# Altium schematic sheet 04-LCD.SchDoc
size C
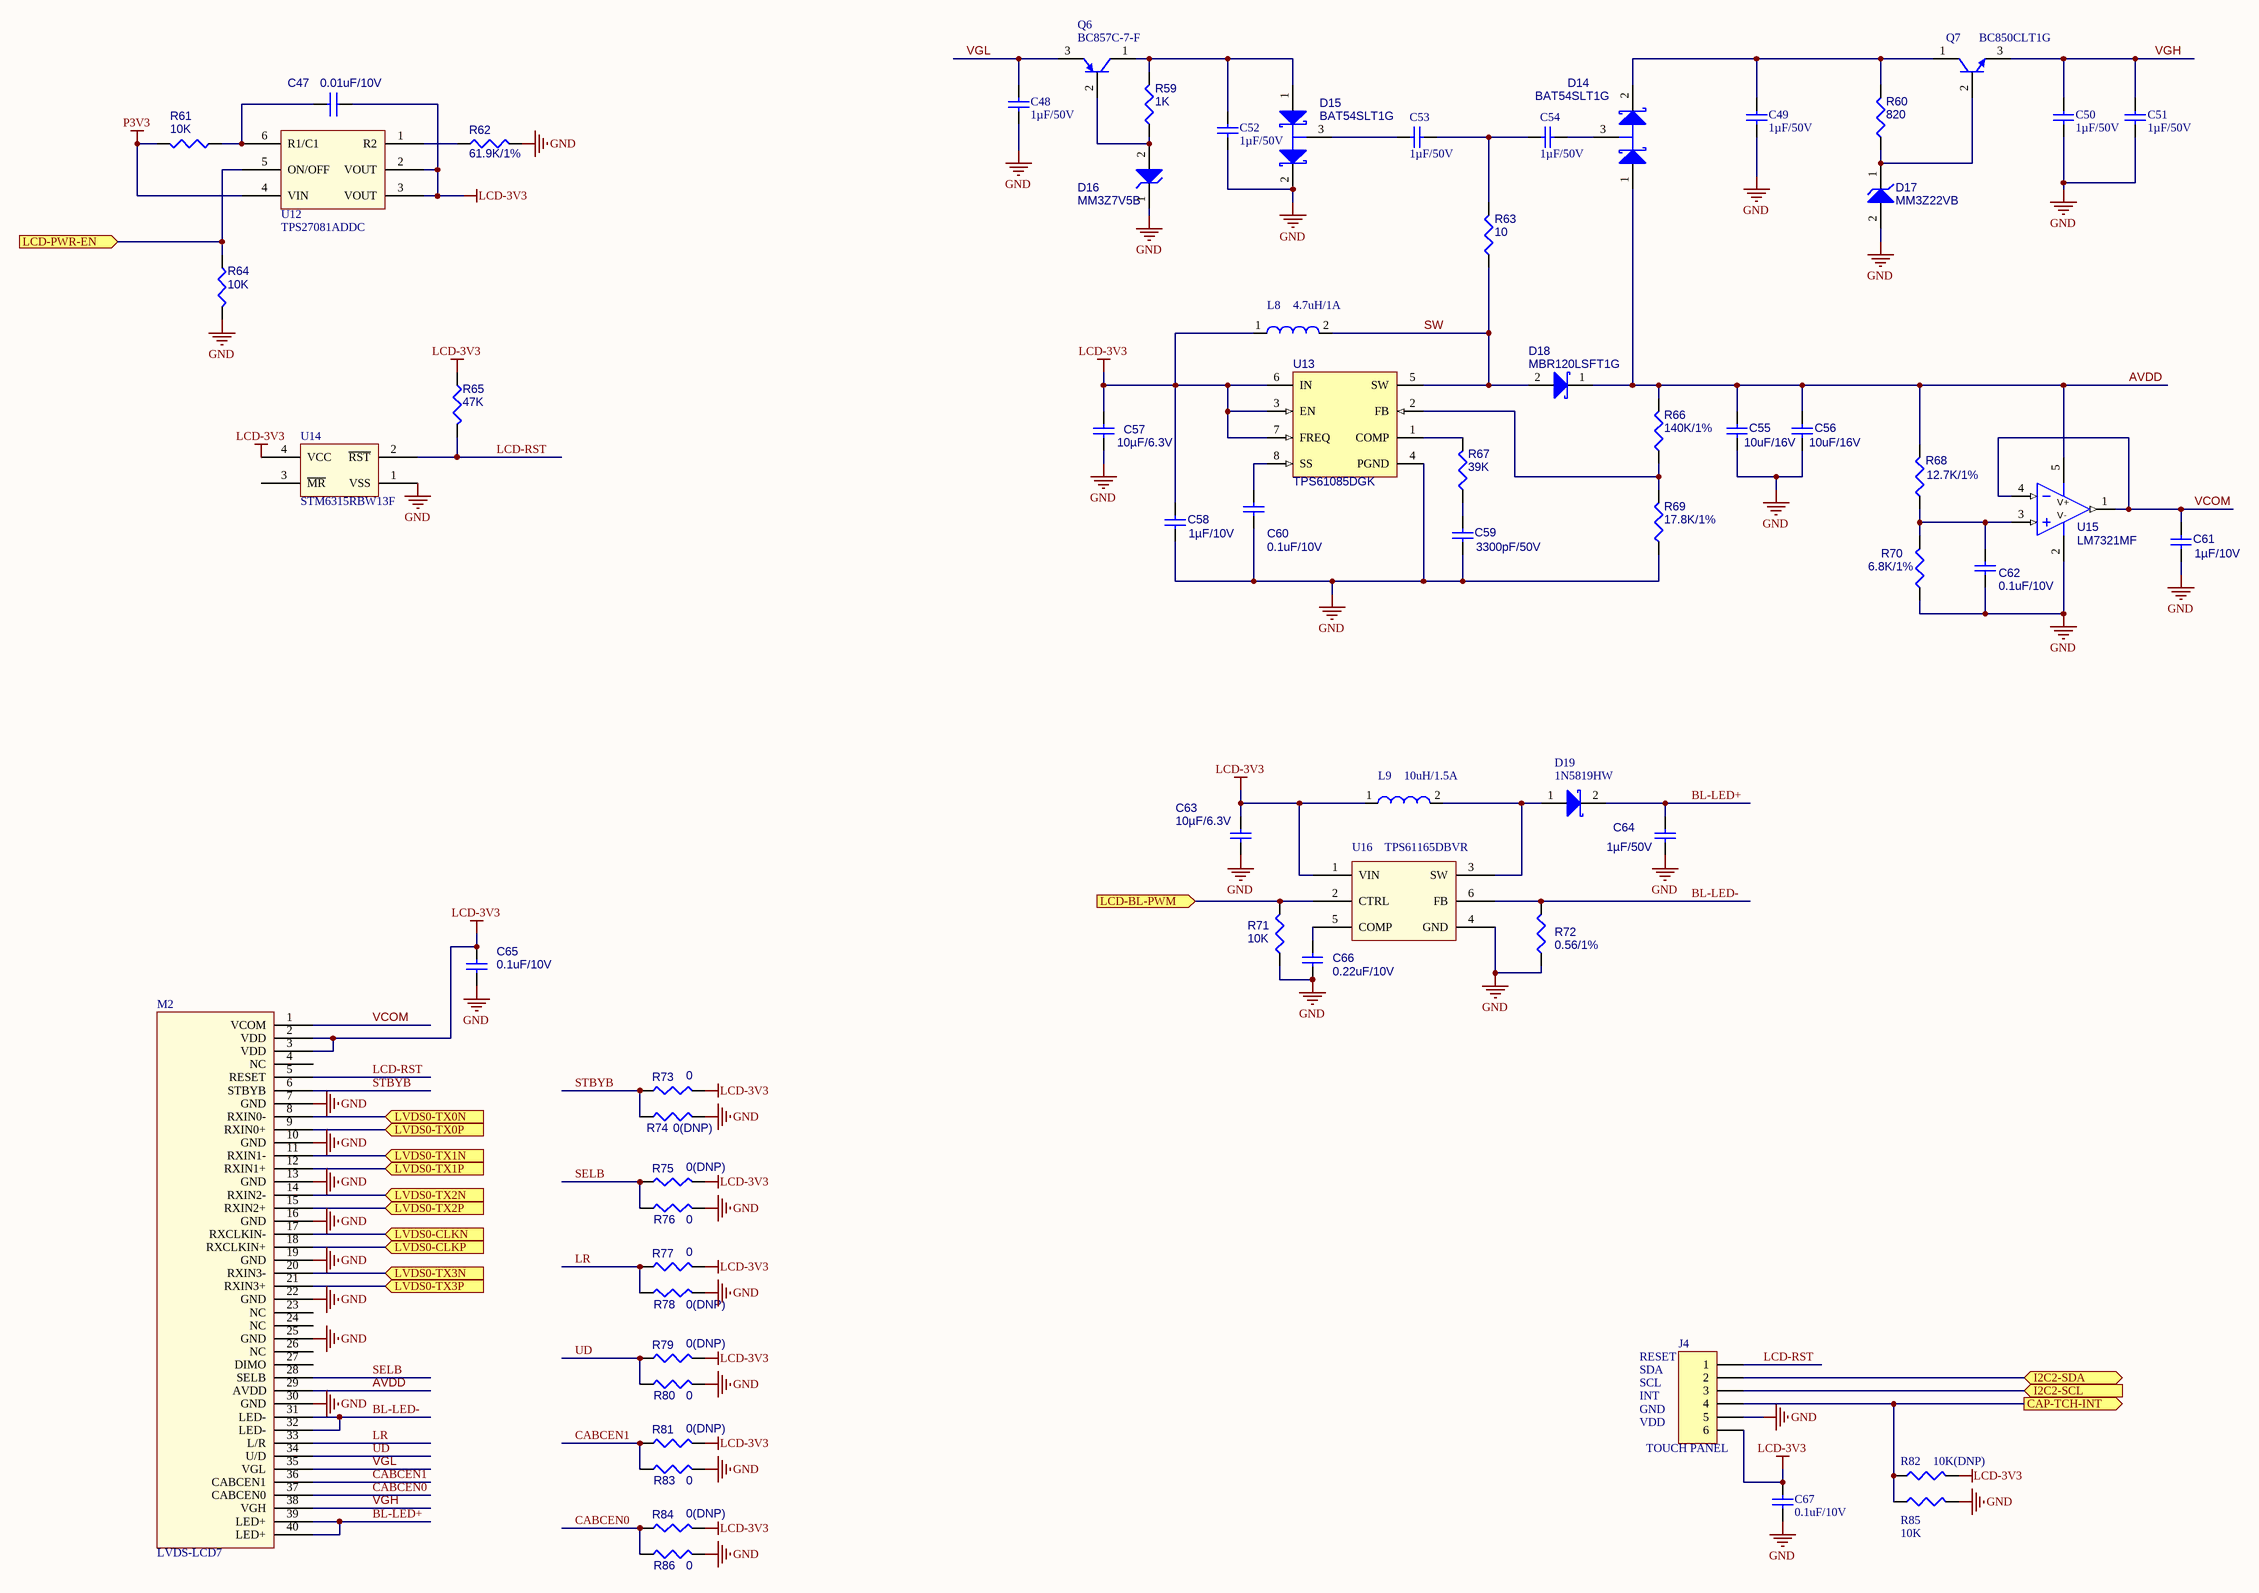
[diagram p0: 04-LCD.SchDoc]

## Parts
C47  0.01uF/10V  [0402]
C48  1µF/50V  [0603]
C49  1µF/50V  [0603]
C50  1µF/50V  [0603]
C51  1µF/50V  [0603]
C52  1µF/50V  [0603]
C53  1µF/50V  [0603]
C54  1µF/50V  [0603]
C55  10uF/16V  [0805]
C56  10uF/16V  [0805]
C57  10µF/6.3V  [0805]
C58  1µF/10V  [0402]
C59  3300pF/50V  [0402]
C60  0.1uF/10V  [0402]
C61  1µF/10V  [0402]
C62  0.1uF/10V  [0402]
C63  10µF/6.3V  [0805]
C64  1µF/50V  [0603]
C65  0.1uF/10V  [0402]
C66  0.22uF/10V  [0402]
C67  0.1uF/10V  [0402]
D14  BAT54SLT1G  [SOT-23]
D15  BAT54SLT1G  [SOT-23]
D16  MM3Z7V5B  [SOD323F]
D17  MM3Z22VB  [SOD323F]
D18  MBR120LSFT1G  [SOD123FL]
D19  1N5819HW  [1N5819]
J4  TOUCH PANEL  [FPC0.5-DR-SMD-XP-F(6P)]
L8  4.7uH/1A  [IND-4.7UH-1A]
L9  10uH/1.5A  [IND-10UH-1.5A]
M2  LVDS-LCD7  [FPC0.5-DR-SMD-XP-F(40P)]
Q6  BC857C-7-F  [NPN]
Q7  BC850CLT1G  [NPN]
R59  1K  [0603]
R60  820  [0603]
R61  10K  [0402]
R62  61.9K/1%  [0402]
R63  10  [0603]
R64  10K  [0402]
R65  47K  [0402]
R66  140K/1%  [0402]
R67  39K  [0402]
R68  12.7K/1%  [0402]
R69  17.8K/1%  [0402]
R70  6.8K/1%  [0402]
R71  10K  [0402]
R72  0.56/1%  [0805]
R73  0  [0402]
R74  0(DNP)  [0402]
R75  0(DNP)  [0402]
R76  0  [0402]
R77  0  [0402]
R78  0(DNP)  [0402]
R79  0(DNP)  [0402]
R80  0  [0402]
R81  0(DNP)  [0402]
R82  10K(DNP)  [0402]
R83  0  [0402]
R84  0(DNP)  [0402]
R85  10K  [0402]
R86  0  [0402]
U12  TPS27081ADDC  [SOT23-6]
U13  TPS61085DGK  [MSOP]
U14  STM6315RBW13F  [SOT143-4]
U15  LM7321MF  [SOT23-5]
U16  TPS61165DBVR  [SOT23-6]

## Ports
CAP-TCH-INT (out), I2C2-SCL (in), I2C2-SDA (bidir), LCD-BL-PWM (in), LCD-PWR-EN (in), LVDS0-CLKN (in), LVDS0-CLKP (in), LVDS0-TX0N (in), LVDS0-TX0P (in), LVDS0-TX1N (in), LVDS0-TX1P (in), LVDS0-TX2N (in), LVDS0-TX2P (in), LVDS0-TX3N (in), LVDS0-TX3P (in)

## Nets
GND: C48.1 C49.2 C50.2 C51.2 C52.2 C55.2 C56.2 C57.2 C58.2 C59.2 C60.2 C61.2 C62.2 C63.2 C64.2 C65.2 C66.2 C67.2 D15.2(K) D16.1(K) D17.2(A) J4.5 M2.7(GND) M2.10(GND) M2.13(GND) M2.16(GND) M2.19(GND) M2.22(GND) M2.25(GND) M2.30(GND) R62.1 R64.1 R69.2 R70.2 R71.2 R72.2 R74.1 R76.1 R78.1 R80.1 R83.1 R85.2 R86.1 U13.4(PGND) U14.1(VSS) U15.2(V-) U16.4(GND)
LCD-3V3: C47.1 C57.1 C58.1 C63.1 C65.1 C67.1 J4.6 L8.1 L9.1 M2.2(VDD) M2.3(VDD) R65.2 R73.1 R75.1 R77.1 R79.1 R81.1 R82.2 R84.1 U12.2(VOUT) U12.3(VOUT) U13.3(EN) U13.6(IN) U13.7(FREQ) U14.4(VCC) U16.1(VIN)
P3V3: R61.1 U12.4(VIN)
AVDD: C55.1 C56.1 D14.1(A) D18.1(K) M2.29(AVDD) R66.1 R68.1 U15.5(V+)
BL-LED+: C64.1 D19.2(K) M2.39(LED+) M2.40(LED+)
BL-LED-: M2.31(LED-) M2.32(LED-) R72.1 U16.6(FB)
CABCEN0: M2.37(CABCEN0) R84.2 R86.2
CABCEN1: M2.36(CABCEN1) R81.2 R83.2
CAP-TCH-INT: J4.4 R82.1 R85.1 ; port CAP-TCH-INT
I2C2-SCL: J4.3 ; port I2C2-SCL
I2C2-SDA: J4.2 ; port I2C2-SDA
LCD-BL-PWM: R71.1 U16.2(CTRL) ; port LCD-BL-PWM
LCD-PWR-EN: R64.2 U12.5(ON/OFF) ; port LCD-PWR-EN
LCD-RST: J4.1 M2.5(RESET) R65.1 U14.2(~{RST})
LR: M2.33(L/R) R77.2 R78.2
LVDS0-CLKN: M2.17(RXCLKIN-) ; port LVDS0-CLKN
LVDS0-CLKP: M2.18(RXCLKIN+) ; port LVDS0-CLKP
LVDS0-TX0N: M2.8(RXIN0-) ; port LVDS0-TX0N
LVDS0-TX0P: M2.9(RXIN0+) ; port LVDS0-TX0P
LVDS0-TX1N: M2.11(RXIN1-) ; port LVDS0-TX1N
LVDS0-TX1P: M2.12(RXIN1+) ; port LVDS0-TX1P
LVDS0-TX2N: M2.14(RXIN2-) ; port LVDS0-TX2N
LVDS0-TX2P: M2.15(RXIN2+) ; port LVDS0-TX2P
LVDS0-TX3N: M2.20(RXIN3-) ; port LVDS0-TX3N
LVDS0-TX3P: M2.21(RXIN3+) ; port LVDS0-TX3P
SELB: M2.28(SELB) R75.2 R76.2
STBYB: M2.6(STBYB) R73.2 R74.2
SW: D18.2(A) L8.2 R63.2 U13.5(SW)
UD: M2.34(U/D) R79.2 R80.2
VCOM: C61.1 M2.1(VCOM) U15.1(OUT) U15.4(IN-)
VGH: C50.1 C51.1 M2.38(VGH) Q7.3(E)
VGL: C48.2 M2.35(VGL) Q6.3(E)
NetC47_2: C47.2 R61.2 U12.6(R1/C1)
NetC49_1: C49.1 D14.2(K) Q7.1(C) R60.1
NetC52_1: C52.1 D15.1(A) Q6.1(C) R59.1
NetC53_1: C53.1 C54.2 R63.1
NetC53_2: C53.2 D15.3(C)
NetC54_1: C54.1 D14.3(C)
NetC59_1: C59.1 R67.2
NetC60_1: C60.1 U13.8(SS)
NetC62_1: C62.1 R68.2 R70.1 U15.3(IN+)
NetC66_1: C66.1 U16.5(COMP)
NetD16_2: D16.2(A) Q6.2(B) R59.2
NetD17_1: D17.1(K) Q7.2(B) R60.2
NetD19_1: D19.1(A) L9.2 U16.3(SW)
NetR62_2: R62.2 U12.1(R2)
NetR66_2: R66.2 R69.1 U13.2(FB)
NetR67_1: R67.1 U13.1(COMP)

Not connected (* = marked no-connect by the designer): M2 4(NC) 23(NC) 24(NC) 26(NC) 27(DIMO); U14 3(~{MR})

## Notes on the sheet
- (near J4) RESET
- INT
- SDA
- SCL
- VDD
- GND

## Library data of the parts
C47 = P_CAP NP
C48-C54 = Cap: Capacitor; Value: 100pF; Published: 8-Jun-2000; LatestRevisionDate: 17-Jul-2002; LatestRevisionNote: Re-released for DXP Platform.; PackageReference: RAD-0.3; Publisher: Altium Limited; PackageDescription: Radial Cap, Thru-Hole; 2 Leads; 0.3 in Pin Spacing
C55 C56 = C2012X5R1E106K125AB: CAP, CERM, 10 µF, 25 V, +/- 10%, X5R, 0805; Manufacturer: TDK; Polarized: N; CompType: Capacitor; Value: 10uF; ValueDisplayed: 10µF; U/M: EA; Cap_F: 0.00001; Tolerance_%: 10; Value1: Unknown; VDC_V: 25; Value2: 25V; TaMin_C: -55; TaMax_C: 85; SymbolVersion: 2008-07-09; PartNumber: C2012X5R1E106K125AB; PackageReference: 0805; RoHS: Y; MountType: SMT; Technology: Ceramic; TempCo: X5R; Cap_Case: 0805; Published: 2008-06-19; Publisher: Texas Instruments; LatestRevisionDate: 2014-11-07; ComponentLink1Description: Datasheet link; ComponentLink1URL: http://www.tdk.com/pdf/TDKMLCCCapRange.pdf; Supplier 1: Digi-Key; Supplier Part Number 1: 445-5984-1-ND
C57 C63 = GRM219R61A106KE44D: CAP, CERM, 10 µF, 10 V, +/- 10%, X5R, 0805; Manufacturer: MuRata; Polarized: N; CompType: Capacitor; Value: 10uF; U/M: EA; Cap_F: 0.00001; Tolerance_%: 10; ESR_ohm: 0.005; Value1: 0.005 ohm; Value2: 10V; TaMin_C: -55; TaMax_C: 85; SymbolVersion: 2008-07-09; PartNumber: GRM219R61A106KE44D; ValueDisplayed: 10µF/6.3V; PackageReference: 0805; RoHS: Y; VDC_V: 10; MountType: SMT; Technology: Ceramic; TempCo: X5R; Cap_Case: 0805; Published: 2008-06-19; Publisher: Texas Instruments; LatestRevisionDate: 2014-11-07; ComponentLink1Description: Datasheet link; ComponentLink1URL: http://psearch.murata.com/capacitor/product/GRM219R61A106KE44%23.pdf; Supplier 1: Digi-Key; Supplier Part Number 1: 490-4735-1-ND; Supplier 2: Mouser; Supplier Part Number 2: 81-GRM219R61A106KE4D; Supplier 3: Farnell; Supplier Part Number 3: 1845741
C58 C61 = GRM188R61H105KAALD: CAP, CERM, 1 µF, 50 V, +/- 10%, X5R, 0603; Manufacturer: MuRata; Polarized: N; CompType: Capacitor; Value: 1uF; ValueDisplayed: 1µF/50V; U/M: EA; Cap_F: 0.000001; Tolerance_%: 10; Value1: Unknown; VDC_V: 50; Value2: 50V; TaMin_C: -55; TaMax_C: 85; Cap_Case: 0603; SymbolVersion: 2008-07-09; PartNumber: GRM188R61H105KAALD; PackageReference: 0603; RoHS: Y; MountType: SMT; Technology: Ceramic; TempCo: X5R; Published: 2008-06-19; Publisher: Texas Instruments; LatestRevisionDate: 2014-11-07; ComponentLink1Description: Datasheet link; ComponentLink1URL: http://psearch.murata.com/capacitor/product/GRM188R61H105KAAL%23.pdf; Supplier 1: Farnell; Supplier Part Number 1: 1845736; Supplier 2: Newark; Supplier Part Number 2: 13T1194
C59 = GRM155R71H332KA01D: CAP, CERM, 3300 pF, 50 V, +/- 10%, X7R, 0402; Manufacturer: MuRata; Polarized: N; CompType: Capacitor; Value: 3300pF; U/M: EA; Cap_F: 0.0000000033; Tolerance_%: 10; Value1: Unknown; VDC_V: 50; Value2: 50V; TaMin_C: -55; TaMax_C: 125; SymbolVersion: 2008-07-09; PartNumber: GRM155R71H332KA01D; ValueDisplayed: 3300pF; PackageReference: 0402; RoHS: Y; MountType: SMT; Technology: Ceramic; TempCo: X7R; Cap_Case: 0402; Published: 2008-06-19; Publisher: Texas Instruments; LatestRevisionDate: 2014-12-17; ComponentLink1Description: Datasheet link; ComponentLink1URL: http://search.murata.co.jp/Ceramy/PnsearchViewAction.do?HnOFG=ON&HnNFG=ON&SEL_CNT=50&sLang=en&sKey=GRM155R71H332KA01D&x=9&y=9&search=startwith; Supplier 1: Digi-Key; Supplier Part Number 1: 490-3248-1-ND; Supplier 2: Mouser; Supplier Part Number 2: 81-GRM36X332K50
C60 C62 C65 C66 = GRM155R71C104KA88D: CAP, CERM, 0.1 µF, 16 V, +/- 10%, X7R, 0402; Manufacturer: MuRata; Polarized: N; CompType: Capacitor; Value: 0.1uF; ValueDisplayed: 0.1µF; U/M: EA; Cap_F: 0.0000001; Tolerance_%: 10; Value1: Unknown; VDC_V: 16; Value2: 16V; TaMin_C: -55; TaMax_C: 125; SymbolVersion: 2008-07-09; PartNumber: GRM155R71C104KA88D; PackageReference: 0402; RoHS: Y; MountType: SMT; Technology: Ceramic; TempCo: X7R; Cap_Case: 0402; Published: 2008-06-19; Publisher: Texas Instruments; LatestRevisionDate: 2014-11-07; ComponentLink1Description: Datasheet link; ComponentLink1URL: http://search.murata.co.jp/Ceramy/PnsearchViewAction.do?HnOFG=ON&HnNFG=ON&SEL_CNT=50&sLang=en&sKey=GRM155R71C104KA88D&x=9&y=9&search=startwith; Supplier 1: Digi-Key; Supplier Part Number 1: 490-3261-1-ND; Supplier 2: Mouser; Supplier Part Number 2: 81-GRM155R71C104KA88; Supplier 3: Farnell; Supplier Part Number 3: 8819742
C64 = GRM188R61H105KAALD: CAP, CERM, 1 µF, 50 V, +/- 10%, X5R, 0603; Manufacturer: MuRata; Polarized: N; CompType: Capacitor; Value: 1uF; U/M: EA; Cap_F: 0.000001; Tolerance_%: 10; Value1: Unknown; VDC_V: 50; Value2: 50V; TaMin_C: -55; TaMax_C: 85; SymbolVersion: 2008-07-09; PartNumber: GRM188R61H105KAALD; ValueDisplayed: 1µF/50V; PackageReference: 0603; RoHS: Y; MountType: SMT; Technology: Ceramic; TempCo: X5R; Cap_Case: 0603; Published: 2008-06-19; Publisher: Texas Instruments; LatestRevisionDate: 2014-11-07; ComponentLink1Description: Datasheet link; ComponentLink1URL: http://psearch.murata.com/capacitor/product/GRM188R61H105KAAL%23.pdf; Supplier 1: Farnell; Supplier Part Number 1: 1845736; Supplier 2: Newark; Supplier Part Number 2: 13T1194
C67 = Cap: Capacitor; Published: 8-Jun-2000; LatestRevisionDate: 17-Jul-2002; LatestRevisionNote: Re-released for DXP Platform.; PackageReference: RAD-0.3; Publisher: Altium Limited; PackageDescription: Radial Cap, Thru-Hole; 2 Leads; 0.3 in Pin Spacing
D14 D15 = BAT54SLT1G: Diode, Schottky, 30 V, 0.2 A, SOT-23; Manufacturer: ON Semiconductor; U/M: EA; Vf_V: 0.8; Value: 30V; Value1: 0.2A; Value2: 0.8V; Io_A: 0.2; Vr_V: 30; TJmax_C: 150; SymbolVersion: 2008-12-08; PartNumber: BAT54SLT1G; PackageReference: SOT-23; CompType: Diode; MountType: SMT; Type: Schottky; RoHS: Y; Published: 2008-06-26; Publisher: Texas Instruments; LatestRevisionDate: 2014-11-07; ComponentLink1Description: Datasheet link; ComponentLink1URL: http://www.onsemi.com/pub_link/Collateral/BAT54SLT1-D.PDF; Supplier 1: Digi-Key; Supplier Part Number 1: BAT54SLT1GOSCT-ND; Supplier 2: Mouser; Supplier Part Number 2: 863-BAT54SLT1G; Supplier 3: Farnell; Supplier Part Number 3: 1431114
D16 = MM3Z7V5B: Diode, Zener, 7.5 V, 200 mW, SOD-323F; Manufacturer: Fairchild Semiconductor; SymbolCreator: a0412235; Value: 7.5V; U/M: EA; Power_W: 0.2; Vz_V: 7.5; Value1: 0.2W; RJA_CperW: 595; SymbolVersion: 2010-08-25; PartNumber: MM3Z7V5B; PackageReference: SOD-323F; CompType: Zener; Vr_V: N/A; MountType: SMT; RoHS: Y; ComponentLink1Description: Datasheet link; ComponentLink1URL: https://www.fairchildsemi.com/datasheets/MM/MM3Z10VB.pdf; Published: 2008-10-08; Publisher: Texas Instruments; LatestRevisionDate: 2014-12-10; LatestRevisionNote: Updated Supplier Data; Supplier 1: Digi-Key; Supplier Part Number 1: MM3Z7V5BCT-ND; Supplier 2: Mouser; Supplier Part Number 2: 512-MM3Z7V5B
D17 = MM3Z18VB: Diode, Zener, 18 V, 200 mW, SOD-323F; Manufacturer: Fairchild Semiconductor; SymbolCreator: a0412235; Value: 18V; U/M: EA; Power_W: 0.2; Vz_V: 18; Value1: 0.2W; RJA_CperW: 595; SymbolVersion: 2010-08-25; PartNumber: MM3Z18VB; PackageReference: SOD-323F; CompType: Zener; Vr_V: N/A; MountType: SMT; RoHS: Y; ComponentLink1Description: Datasheet link; ComponentLink1URL: https://www.fairchildsemi.com/datasheets/MM/MM3Z10VB.pdf; Published: 2008-10-08; Publisher: Texas Instruments; LatestRevisionDate: 2014-12-10; LatestRevisionNote: Updated Supplier Data; Supplier 1: Digi-Key; Supplier Part Number 1: MM3Z18VBCT-ND; Supplier 2: Mouser; Supplier Part Number 2: 512-MM3Z18VB
D18 = MBR120LSFT1G: Diode, Schottky, 20 V, 1 A, SOD-123FL; Manufacturer: ON Semiconductor; U/M: EA; Vf_V: 0.45; Value: 20V; Value1: 1A; Value2: 0.45V; Io_A: 1; Vr_V: 20; TJmax_C: 125; RJC_CperW: 26; CompType: Diode; SymbolVersion: 2008-12-08; PartNumber: MBR120LSFT1G; PackageReference: SOD-123FL; MountType: SMT; Type: Schottky; RoHS: Y; Published: 2008-06-26; Publisher: Texas Instruments; LatestRevisionDate: 2014-11-07; ComponentLink1Description: Datasheet link; ComponentLink1URL: http://www.onsemi.com/pub_link/Collateral/MBR120LSFT1-D.PDF; Supplier 1: Digi-Key; Supplier Part Number 1: MBR120LSFT1GOSCT-ND; Supplier 2: Mouser; Supplier Part Number 2: 863-MBR120LSFT1G; Supplier 3: Farnell; Supplier Part Number 3: 1431042
D19 = Diode 11DQ03: Schottky Rectifier
J4 = Header 6: Header, 6-Pin; LatestRevisionDate: 17-Jul-2002; LatestRevisionNote: Re-released for DXP Platform.; Publisher: Altium Limited
L8 L9 = INDUCTOR: IND PWR 4.7UH@1MHZ 1A 20% SMD; PART_TYPE: INDUCTOR\POWER; CLASS: DISCRETE; SIGNAL_MODEL: DEFAULT_INDUCTOR_4700nH_2_1; PRIORITY_PN: 024-00152; CAD_APPROVED: Yes; MFG_PN01: VLS3012T-4R7M1R0; MFG_NAME01: TDK; AGILE_PN: 180-77706; ROOM: RGMII_PHY; HEIGHT: 1.2MM; ROHS: Yes; Tolerance: 20%
Q6 = PNP: PNP Bipolar Transistor; Published: 8-Jun-2000; LatestRevisionDate: 29-May-2009; LatestRevisionNote: IPC-7351 Footprint Added.; PackageVersion: Aug-1999; PackageReference: SOT-23B; Publisher: Altium Limited; PackageDescription: 3-Pin SOT-23 Package 0.95 mm Pitch, 2.4 mm Lead Span
Q7 = NPN: NPN Bipolar Transistor; Published: 8-Jun-2000; LatestRevisionDate: 17-Jul-2002; LatestRevisionNote: Re-released for DXP Platform.; PackageReference: TO-226-AA; Publisher: Altium Limited; PackageDescription: TO, Flat Index; 3 In-Line, Axial Leads; Body Dia. 4.8mm; Leads 0.55 x 0.51 mm (max); Code_JEDEC: TO-226-AA
R59-R81 R83 R84 R86 = P_R
R82 R85 = CR16-1003FM
U12 = TPS27081A
U13 = TPS61085DGKR: 18.5 V, 2 A, 650 KHz / 1.2 MHz Step-Up DC-DC Converter with Forced PWM Mode, 2.3 to 6 V, -40 to 85 degC, 8-pin SOP (DGK8), Green (RoHS & no Sb/Br); Manufacturer: Texas Instruments; Alternate Manufacturer: None; Alternate PartNumber: Equivalent; Iout(Max)(A): 2; Iq(Typ)(mA): 0.07; Rating: Catalog; SubFamily: White LED Driver; Switching Frequency(Typ)(kHz): 650, 1200; Topology: Boost; Vin(Max)(V): 6; Vin(Min)(V): 2.3; DatasheetVersion: SLVS859; PackageVersion: 4073329/E; PackageReference: DGK0008A; PackageDescription: 8-Pin Thin Small Outline Package 3 x 3 mm Body ,0.65 mm Pitch; Supplier 1: Digi-Key; Supplier Part Number 1: TPS61085DGKR-ND; Supplier 2: Mouser; Supplier Part Number 2: 595-TPS61085DGKR; Eco-Plan: Green (RoHS & no Sb/Br); MountType: SMT; Code_JEDEC: MO-187; PartNumber: TPS61085DGK; ComponentLink1Description: Manufacturer URL; ComponentLink1URL: http://www.ti.com/; ComponentLink2Description: Datasheet; ComponentLink2URL: http://www.ti.com/general/docs/lit/getliterature.tsp?genericPartNumber=TPS61085&fileType=pdf; ComponentLink3Description: Package Specification; ComponentLink3URL: http://www.ti.com/litv/pdf/mpds028d
U14 = STM6315
U15 = LM7321MF: Single 30V High Output Current and Unlimited Capacitive Load Op Amp; Manufacturer: National Semiconductor; Characteristics: LM7321MF Single 30V High Output Current and Unlimited Capacitive Load Op Amp; CompType: OpAmp IC; TaMin_C: -40.0; TaMax_C: 125.0; PowerWise: Y; SymbolVersion: 2008-07-09; PartNumber: LM7321MF; Value: LM7321MF; PackageDescription: 5 Lead SOT-23; PackageReference: MF05A_L; MountType: SMT; RoHS: O; ComponentLink1Description: LM7321 Datasheet; ComponentLink1URL: http://www.ti.com/lit/gpn/LM7321; ComponentLink2Description: LM7321 Web Page; ComponentLink2URL: http://www.ti.com/product/LM7321; ComponentLink3Description: MF05A Package Web Page; ComponentLink3URL: http://www.national.com/packaging/folders/mf05a.html; Version: B1.743; LatestRevisionDate: 2012-11-01; LatestRevisionNote: Mass Update; Publisher: National Semiconductor; Published: 2012-11-01